# Altium project 24V-20A-Power-Board-v1.0.PrjPcb (part 3 of 5)
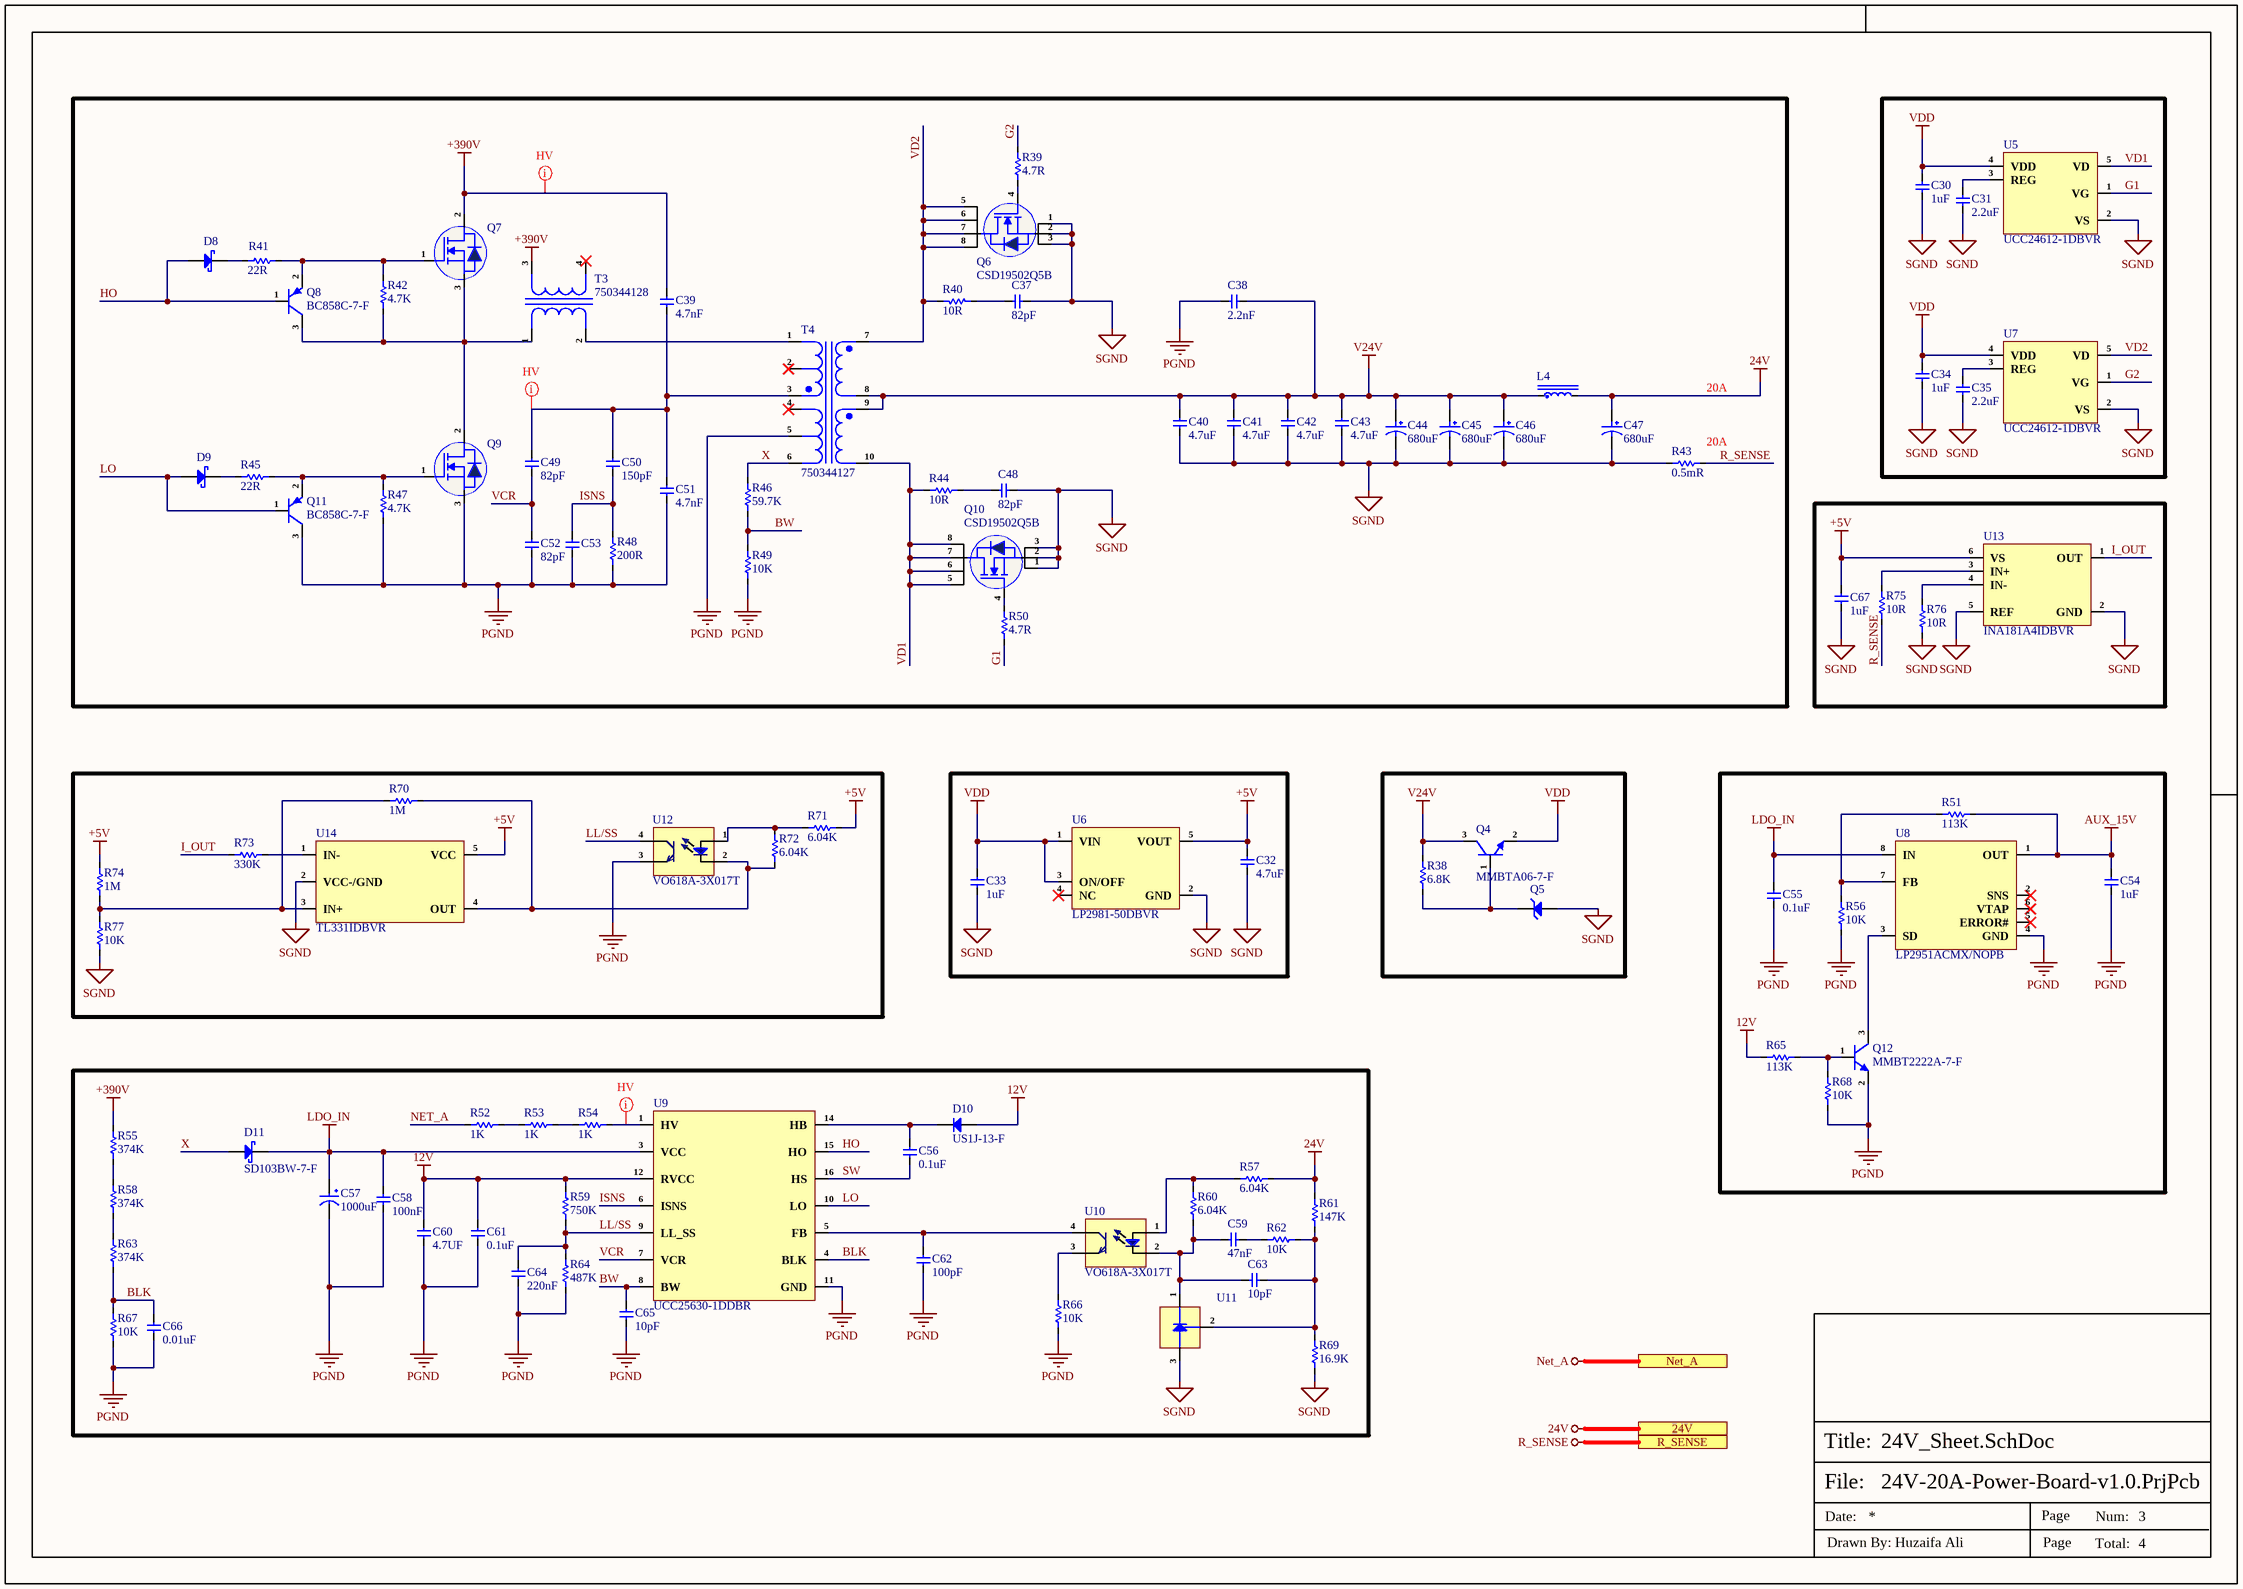
[diagram p5: 24V_Sheet.SchDoc]

## Sheet 24V_Sheet.SchDoc (continued)

### Library data of the parts (continued)
R48 = RC0805FR-07200RL: RES 200 OHM 1% 1/8W 0805; Manufacturer: Yageo; Temperature Coefficient: 100ppm/°C; Voltage Rating (DC): 150V; Power Rating: 125mW; Item Type: Resistor; Supplier: Future Electronics; Supplier Part Number: 6109607; Manufacturer Part Number: RC0805FR-07200RL; RoHS: Yes; Category: Chip SMD Resistors; Stock: 1070000; Pricing: 5000=0.0026, 25000=0.0024, 125000=0.0023, 500000=0.0022, 1250000=0.002 (USD); Mounting Technology: Surface Mount; Case/Package: 0805; Case Code (Metric): 2012; Case Code (Imperial): 0805; Min Operating Temperature: -55°C; Max Operating Temperature: 155°C; Tolerance: 1%; Value: 200R; Packaging: Tape and Reel; Voltage Rating: 150V; Number of Terminations: 2; Termination: SMD/SMT; Max Power Dissipation: 125mW; Features: Moisture Resistant; Series: RC; Construction: Rectangular; Length: 2mm; Depth: 1.25mm; Lead Free: Lead Free; Military Standard: Not; RoHS Compliant: Yes; ComponentLink1URL: https://datasheet.ciiva.com/12667/rc0805-12667066.pdf?src-supplier=Mouser; ComponentLink1Description: https://datasheet.ciiva.com/12667/rc0805-12667066.pdf?src-supplier=Mouser; ComponentLink2URL: https://datasheet.ciiva.com/2519/pyu-r-int-thick-7-2519721.pdf?src-supplier=Digi-Key; ComponentLink2Description: https://datasheet.ciiva.com/2519/pyu-r-int-thick-7-2519721.pdf?src-supplier=Digi-Key; ComponentLink3URL: https://datasheet.ciiva.com/2519/pyu-r-int-thick-7-2519722.pdf?src-supplier=Digi-Key; ComponentLink3Description: https://datasheet.ciiva.com/2519/pyu-r-int-thick-7-2519722.pdf?src-supplier=Digi-Key; ComponentLink4URL: https://datasheet.ciiva.com/2519/pyu-r-int-thick-7-2519720.pdf?src-supplier=Digi-Key; ComponentLink4Description: https://datasheet.ciiva.com/2519/pyu-r-int-thick-7-2519720.pdf?src-supplier=Digi-Key; ComponentLink5URL: https://datasheet.ciiva.com/15189/getdatasheetpartid-327982-15189926.pdf?src-supplier=Verical; ComponentLink5Description: https://datasheet.ciiva.com/15189/getdatasheetpartid-327982-15189926.pdf?src-supplier=Verical; LCSC Part Number: C114567
R49 R56 R62 R66-R68 R77 = RC0603FR-0710KL: RES SMD 10K Ohm 1% 1/10W 0603; Manufacturer: Yageo; Resistance: 10kR; Temperature Coefficient: 100ppm/°C; Voltage Rating (DC): 50V; Power Rating: 100mW; Voltage Rating: 75V; Item Type: Resistor; Supplier 1: Digi-Key; Manufacturer Part Number: RC0603FR-0710KL; RoHS: Yes; Category: Chip SMD Resistors; Stock 1: 25249139; Pricing 1: 1=0.10000, 10=0.02400, 100=0.00970, 1000=0.00436, 2500=0.00378 (USD); Case/Package: 0603; Number of Pins: 2; Case Code (Imperial): 0603; Case Code (Metric): 1608; Weight: 7.1E-05oz; Size Code: 0603; Min Operating Temperature: -55°C; Max Operating Temperature: 155°C; Tolerance: 1%; Resistor Type: Thick Film; Packaging: Tape and Reel; Termination: SMD/SMT; Features: Moisture Resistant; Series: RC; Max Power Dissipation: 100mW; Number of Terminations: 2; Resistance Tolerance: 1%; Construction: Rectangular; Length: 1.6mm; Width: 0.8mm; Height: 0.45mm; Depth: 0.8mm; Lead Pitch: 0.3mm; REACH SVHC: Unknown; Lead Free: Lead Free; Military Standard: Not; RoHS Compliant: Yes; ComponentLink1URL: https://datasheet.ciiva.com/7660/38590-7660789.pdf?src-supplier=Element14; ComponentLink1Description: https://datasheet.ciiva.com/7660/38590-7660789.pdf?src-supplier=Element14; ComponentLink2URL: https://datasheet.ciiva.com/7983/443971-7983596.pdf?src-supplier=Element14; ComponentLink2Description: https://datasheet.ciiva.com/7983/443971-7983596.pdf?src-supplier=Element14; ComponentLink3URL: https://datasheet.ciiva.com/22747/443971-22747519.pdf?src-supplier=Element14; ComponentLink3Description: https://datasheet.ciiva.com/22747/443971-22747519.pdf?src-supplier=Element14; ComponentLink4URL: https://datasheet.ciiva.com/46440/1868787-46440891.pdf?src-supplier=Element14; ComponentLink4Description: https://datasheet.ciiva.com/46440/1868787-46440891.pdf?src-supplier=Element14; ComponentLink5URL: https://datasheet.ciiva.com/7746/1738695-7746239.pdf?src-supplier=Element14; ComponentLink5Description: https://datasheet.ciiva.com/7746/1738695-7746239.pdf?src-supplier=Element14; ComponentLink6URL: https://datasheet.ciiva.com/15189/getdatasheetpartid-409289-15189591.pdf?src-supplier=Verical; ComponentLink6Description: https://datasheet.ciiva.com/15189/getdatasheetpartid-409289-15189591.pdf?src-supplier=Verical; Supplier Part Number 1: 311-10.0KHRCT-ND; LCSC Part Number: C98220
R51 R65 = RC0603FR-07113KL: RES 113K OHM 1% 1/10W 0603; Manufacturer: Yageo; Value: 113kR; Temperature Coefficient: 100ppm/°C; Power Rating: 100mW; Voltage Rating: 50V; Supplier: Digikey; Supplier Part Number: 311-113KHRCT-ND; Manufacturer Part Number: RC0603FR-07113KL; RoHS: Yes; Category: Chip SMD Resistors; Stock: 1058641; Pricing: 1=0.1, 10=0.019, 50=0.0112, 100=0.0093, 500=0.00622, 1000=0.00532 (USD); Case/Package: 0603; Contact Plating: Tin,Lead; Case Code (Imperial): 0603; Case Code (Metric): 1608; Min Operating Temperature: -55°C; Max Operating Temperature: 155°C; Tolerance: 1%; Packaging: Tape and Reel; Termination: SMD/SMT; Voltage Rating (DC): 50V; Features: Moisture Resistant; Series: RC; Max Power Dissipation: 100mW; Number of Terminations: 2; Length: 1.6mm; Width: 0.8mm; Height: 0.45mm; Lead Free: Lead Free; RoHS Compliant: Resistor; ComponentLink1URL: http://www.mouser.com/catalog/specsheets/RC0603.pdf?src-supplier=Mouser; ComponentLink1Description: http://www.mouser.com/catalog/specsheets/RC0603.pdf?src-supplier=Mouser; ComponentLink2URL: http://www.yageo.com/pdf/PYu-RC0603_51_RoHS_L_4.pdf?src-supplier=Avnet; ComponentLink2Description: http://www.yageo.com/pdf/PYu-RC0603_51_RoHS_L_4.pdf?src-supplier=Avnet; ComponentLink3URL: http://www.yageo.com/documents/recent/PYu-RC_Group_51_RoHS_L_9.pdf?src-supplier=Digikey; ComponentLink3Description: http://www.yageo.com/documents/recent/PYu-RC_Group_51_RoHS_L_9.pdf?src-supplier=Digikey; ComponentLink4URL: http://www.yageo.com/documents/recent/PYu-RC_Group_51_RoHS_L_10.pdf?src-supplier=Digikey; ComponentLink4Description: http://www.yageo.com/documents/recent/PYu-RC_Group_51_RoHS_L_10.pdf?src-supplier=Digikey; ComponentLink5URL: https://datasheet.octopart.com/RC0603FR-07113KL-Yageo-datasheet-118562.pdf?src-supplier=Digikey; ComponentLink5Description: https://datasheet.octopart.com/RC0603FR-07113KL-Yageo-datasheet-118562.pdf?src-supplier=Digikey; ComponentLink6URL: http://www.yageo.com/documents/recent/PYu-RC0603_51_RoHS_L_7.pdf?src-supplier=Future+Electronics; ComponentLink6Description: http://www.yageo.com/documents/recent/PYu-RC0603_51_RoHS_L_7.pdf?src-supplier=Future+Electronics; ComponentLink7URL: https://datasheet.octopart.com/RC0603FR-07113KL-Yageo-datasheet-164759695.pdf?src-supplier=Future+Electronics; ComponentLink7Description: https://datasheet.octopart.com/RC0603FR-07113KL-Yageo-datasheet-164759695.pdf?src-supplier=Future+Electronics
R52-R54 = RC1206FR-7W1KL: RES 1K OHM 1% 1/2W 1206; Manufacturer: Yageo; Item Type: Resistor; Supplier 1: Digi-Key; Manufacturer Part Number: RC1206FR-7W1KL; RoHS: Yes; Category: Chip SMD Resistors; Stock 1: 6215; Pricing 1: 1=0.19000, 10=0.15700, 100=0.06150, 1000=0.02572, 2500=0.02358 (USD); RoHS Compliant: Yes; Supplier Part Number 1: 13-RC1206FR-7W1KLCT-ND; LCSC Part Number: C859155; ComponentLink1Description: LCSC; ComponentLink1URL: https://www.lcsc.com/product-detail/Chip-Resistor-Surface-Mount_YAGEO-RC1206FR-7W1KL_C859155.html
R55 R58 R63 = RNCF1206DTE374K: RES SMD 374K OHM 0.5% 1/4W 1206; Manufacturer: Stackpole Electronics; Item Type: Resistors; Value: 374kR; Max Power Dissipation: 250mW; Temperature Coefficient: 25ppm/°C; Supplier: Digikey; LCSC Part Number: C346652; Manufacturer Part Number: RNCF1206DTE374K; RoHS: Yes; Pricing: 5000=0.03682 (USD); Mounting Technology: Surface Mount; Case/Package: 1206; Case Code (Metric): 3216; Case Code (Imperial): 1206; Min Operating Temperature: -55°C; Max Operating Temperature: 155°C; Tolerance: 0.5%; Packaging: Cut Tape; Number of Terminations: 2; Features: Moisture Resistant; Series: RNCF; Length: 0.126inch; Width: 0.063inch; Height: 0.026inch; RoHS Compliant: Yes; ComponentLink1URL: https://www.seielect.com/Catalog/SEI-RNCF.pdf?src-supplier=Digikey; ComponentLink1Description: https://www.seielect.com/Catalog/SEI-RNCF.pdf?src-supplier=Digikey
R57 R60 R71 R72 = RC0402FR-076K04L: RES 6.04K OHM 1% 1/16W 0402; Manufacturer: Yageo; Resistance: 6.04kR; Temperature Coefficient: 100ppm/°C; Power Rating: 62.5mW; Voltage Rating: 50V; Max Power Dissipation: 63mW; Supplier 1: Mouser; Manufacturer Part Number: RC0402FR-076K04L; RoHS: Yes; Category: Chip SMD Resistors; Stock 1: 365311; Pricing 1: 1=0.10000, 10=0.01200, 50=0.01200, 100=0.00500, 1000=0.00300, 2500=0.00200, 10000=0.00100 (USD); Case/Package: 0402; Contact Plating: Tin,Matte; Case Code (Imperial): 0402; Case Code (Metric): 1005; Min Operating Temperature: -55°C; Max Operating Temperature: 155°C; Tolerance: 1%; Resistor Type: Thick Film; Packaging: Tape and Reel; Package Quantity: 10000; Number of Terminations: 2; Termination: SMD/SMT; Voltage Rating (DC): 50V; Working Voltage: 50V; Features: Moisture Resistant; Series: RC; Technology: THICK FILM; Construction: Rectangular; Length: 1mm; Width: 0.02inch; Height: 0.016inch; Depth: 0.5mm; Military Standard: Not; Lead Free: Lead Free; RoHS Compliant: Yes; ComponentLink1URL: https://datasheet.ciiva.com/5558/pyu-rc0402-51-rohs-l-6-r-5558087.pdf?src-supplier=Mouser; ComponentLink1Description: https://datasheet.ciiva.com/5558/pyu-rc0402-51-rohs-l-6-r-5558087.pdf?src-supplier=Mouser; ComponentLink2URL: https://datasheet.ciiva.com/8892/pyu-rc0402-51-rohs-l-6-8892414.pdf?src-supplier=Avnet; ComponentLink2Description: https://datasheet.ciiva.com/8892/pyu-rc0402-51-rohs-l-6-8892414.pdf?src-supplier=Avnet; ComponentLink3URL: https://datasheet.ciiva.com/2552/pyu-r-int-thick-7-2552970.pdf?src-supplier=Digi-Key; ComponentLink3Description: https://datasheet.ciiva.com/2552/pyu-r-int-thick-7-2552970.pdf?src-supplier=Digi-Key; Supplier Part Number 1: 603-RC0402FR-076K04L; LCSC Part Number: C97819
R59 = 0603WAF7503T5E: 100mW Thick Film Resistors 75V ±100ppm/℃ ±1% 750kΩ 0603 Chip Resistor - Surface Mount ROHS; Manufacturer: UNI-ROYAL; Manufacturer Part Number: 0603WAF7503T5E; Package: 0603; LCSC Part Number: C23240; Item Type: Resistor; ComponentLink1Description: LCSC; ComponentLink1URL: https://www.lcsc.com/product-detail/Chip-Resistor-Surface-Mount_UNI-ROYAL-Uniroyal-Elec-0603WAF7503T5E_C23240.html
R61 = RT0603DRD07147KL: RES SMD 147K OHM 0.5% 1/10W 0603; Manufacturer: Yageo; Power Rating: 100mW; Voltage Rating (DC): 50V; Value: 147kR; Temperature Coefficient: 25ppm/°C; Item Type: Resistor; Supplier 1: Mouser; Manufacturer Part Number: RT0603DRD07147KL; RoHS: Yes; Category: Chip SMD Resistors; Stock 1: 1848; Pricing 1: 1=0.18000, 10=0.14700, 50=0.14700, 100=0.05600, 1000=0.02400, 10000=0.01800 (USD); Case/Package: 0603; Case Code (Imperial): 0603; Case Code (Metric): 1608; Min Operating Temperature: -55°C; Max Operating Temperature: 155°C; Package Quantity: 10; Tolerance: 0.5%; Packaging: Tape and Reel; Series: RT; Max Power Dissipation: 100mW; Number of Terminations: 2; Length: 1.6mm; Width: 0.8mm; Height: 0.45mm; Lead Free: Lead Free; RoHS Compliant: Yes; ComponentLink1URL: http://www.yageo.com/documents/recent/PYu-RT_1-to-0.01_RoHS_L_9.pdf?src-supplier=Digi-Key; ComponentLink1Description: http://www.yageo.com/documents/recent/PYu-RT_1-to-0.01_RoHS_L_9.pdf?src-supplier=Digi-Key; Supplier Part Number 1: 603-RT0603DRD07147KL; LCSC Part Number: C728612
R64 = RC0603DR-07487KL: RES 487K OHM 0.5% 1/10W 0603; Manufacturer: Yageo; Item Type: Resistors; Value: 487kR; Max Power Dissipation: 100mW; Temperature Coefficient: 100ppm/°C; Supplier: Digikey; LCSC Part Number: C859043; Manufacturer Part Number: RC0603DR-07487KL; RoHS: Yes; Pricing: 5000=0.00887 (USD); Case/Package: 0603; Min Operating Temperature: -55°C; Max Operating Temperature: 155°C; Packaging: Tape and Reel; Number of Terminations: 2; Tolerance: 0.5%; Features: Moisture Resistant; Series: RC; Length: 0.063inch; Width: 0.031inch; Height: 0.022inch; RoHS Compliant: Yes; ComponentLink1URL: http://www.yageo.com.tw/exep/pages/download/literatures/PYu-R_INT-thick_7.pdf?src-supplier=Digikey; ComponentLink1Description: http://www.yageo.com.tw/exep/pages/download/literatures/PYu-R_INT-thick_7.pdf?src-supplier=Digikey
R69 = 0603WAF1692T5E: 100mW Thick Film Resistors 75V ±100ppm/℃ ±1% 16.9kΩ 0603 Chip Resistor - Surface Mount ROHS; Manufacturer: UNI-ROYAL; Manufacturer Part Number: 0603WAF1692T5E; Package: 0603; LCSC Part Number: C25954; Item Type: Resistor; ComponentLink1Description: LCSC; ComponentLink1URL: https://www.lcsc.com/product-detail/Chip-Resistor-Surface-Mount_UNI-ROYAL-Uniroyal-Elec-0603WAF1692T5E_C25954.html
R70 R74 = RC0402FR-071ML: RES 1M OHM 1% 1/16W 0402; Manufacturer: Yageo; Value: 1MR; Power Rating: 63mW; Voltage Rating: 50V; Temperature Coefficient: 100ppm/°C; Item Type: Resistor; Supplier: Digikey; Supplier Part Number: 311-1.00MLRCT-ND; Manufacturer Part Number: RC0402FR-071ML; RoHS: Yes; Category: Chip SMD Resistors; Stock: 6516; Pricing: 1=0.1, 10=0.015, 50=0.0088, 100=0.0073, 500=0.00488, 1000=0.00417, 5000=0.00297 (USD); Case/Package: 0402; Case Code (Imperial): 0402; Case Code (Metric): 1005; Min Operating Temperature: -55°C; Max Operating Temperature: 155°C; Resistor Type: Thick Film; Packaging: Tape and Reel; Tolerance: 1%; Termination: SMD/SMT; Features: Moisture Resistant; Series: RC; Max Power Dissipation: 63mW; Number of Terminations: 2; Resistance Tolerance: 1%; Construction: Rectangular; Technology: THICK FILM; Voltage Rating (AC): 50V; Length: 1mm; Height: 0.32mm; Depth: 0.5mm; RoHS Compliant: Yes; Military Standard: Not; Reach SVHC Compliant: Unknown; Lead Free: 5697LeadFree; ComponentLink1URL: https://datasheet.ciiva.com/11808/0900766b80c66297-11808125.pdf?src-supplier=Rs; ComponentLink1Description: https://datasheet.ciiva.com/11808/0900766b80c66297-11808125.pdf?src-supplier=Rs; ComponentLink2URL: https://datasheet.ciiva.com/46394/1018594-46394951.pdf?src-supplier=Element14; ComponentLink2Description: https://datasheet.ciiva.com/46394/1018594-46394951.pdf?src-supplier=Element14; ComponentLink3URL: https://datasheet.ciiva.com/7849/1018594-7849883.pdf?src-supplier=Element14; ComponentLink3Description: https://datasheet.ciiva.com/7849/1018594-7849883.pdf?src-supplier=Element14; ComponentLink4URL: https://datasheet.ciiva.com/7849/1018594-7849882.pdf?src-supplier=Element14; ComponentLink4Description: https://datasheet.ciiva.com/7849/1018594-7849882.pdf?src-supplier=Element14; ComponentLink5URL: https://datasheet.ciiva.com/16741/pyu-rc0402-51-rohs-l-6-r-16741081.pdf?src-supplier=Future+Electronics; ComponentLink5Description: https://datasheet.ciiva.com/16741/pyu-rc0402-51-rohs-l-6-r-16741081.pdf?src-supplier=Future+Electronics; LCSC Part Number: C138033
R73 = CRCW0402330KFKEDC: RES 330K OHM 1% 1/16W 0402; Manufacturer: Vishay; Power Rating: 63mW; Value: 330kR; Item Type: Resistor; Supplier: Mouser; Supplier Part Number: 71-CRCW0402330KFKEDC; Manufacturer Part Number: CRCW0402330KFKEDC; RoHS: Yes; Category: Chip SMD Resistors; Stock: 34154; Pricing: 1=0.1, 10=0.017, 50=0.017, 100=0.008, 1000=0.005, 10000=0.004 (USD); Case/Package: 0402; Tolerance: 1%; Lead Free: Lead Free; RoHS Compliant: Yes; LCSC Part Number: C3009051
T3 = 750344128: Manufacturer: Wurth Electroniks; Item Type: Transformer; Manufacturer Part Number: 750344128; Package: THT
T4 = 750344127: Manufacturer: Wurth Electroniks; Item Type: Transformer; Manufacturer Part Number: 750344127; Package: THT
U5 U7 = UCC24612-1DBVR: SYNC RECTIFIER FLYBACK; Manufacturer: Texas Instruments; Item Type: IC; Supplier: Mouser; LCSC Part Number: C2657796; Manufacturer Part Number: UCC24612-1DBVR; RoHS: Yes; Stock: 14678; Pricing: 1=0.92, 10=0.757, 50=0.757, 100=0.574, 1000=0.391, 10000=0.302 (USD); ComponentLink1URL: http://www.ti.com/general/docs/suppproductinfo.tsp?distId=10&amp;gotoUrl=http%3A%2F%2Fwww.ti.com%2Flit%2Fgpn%2Fucc24612&src-supplier=Digikey; ComponentLink1Description: http://www.ti.com/general/docs/suppproductinfo.tsp?distId=10&amp;gotoUrl=http%3A%2F%2Fwww.ti.com%2Flit%2Fgpn%2Fucc24612&src-supplier=Digikey
U6 = LP2981-50DBVR: IC REG LINEAR 5V 100MA SOT23-5; Manufacturer: Texas Instruments; Supplier: Mouser; LCSC Part Number: C2877856; Manufacturer Part Number: LP2981-50DBVR; RoHS: Yes; Item Type: IC; Stock: 14435; Pricing: 1=0.34, 10=0.274, 50=0.274, 100=0.203, 1000=0.138, 10000=0.137 (USD); ComponentLink1URL: https://datasheet.ciiva.com/2042/lp2981a-50-2042256.pdf?src-supplier=Digikey; ComponentLink1Description: https://datasheet.ciiva.com/2042/lp2981a-50-2042256.pdf?src-supplier=Digikey; ComponentLink2URL: https://datasheet.ciiva.com/41458/001014295-da-01-en-ic-reg-ldo-5v-0-lp2981-50dbvr-sot-5-tid-41458697.pdf?src-supplier=Conrad; ComponentLink2Description: https://datasheet.ciiva.com/41458/001014295-da-01-en-ic-reg-ldo-5v-0-lp2981-50dbvr-sot-5-tid-41458697.pdf?src-supplier=Conrad; ComponentLink3URL: https://datasheet.ciiva.com/3223/lp2981a-33-3223861.pdf?src-supplier=Avnet; ComponentLink3Description: https://datasheet.ciiva.com/3223/lp2981a-33-3223861.pdf?src-supplier=Avnet; ComponentLink4URL: https://datasheet.ciiva.com/2042/lp2981a-50-2042254.pdf?src-supplier=Digikey; ComponentLink4Description: https://datasheet.ciiva.com/2042/lp2981a-50-2042254.pdf?src-supplier=Digikey; ComponentLink5URL: https://datasheet.ciiva.com/2042/lp2981a-50-2042255.pdf?src-supplier=Digikey; ComponentLink5Description: https://datasheet.ciiva.com/2042/lp2981a-50-2042255.pdf?src-supplier=Digikey
U8 = LP2951ACMX/NOPB: IC REG LIN POS ADJ 100MA 8SOIC; Manufacturer: TI National Semiconductor; Quiescent Current: 75uA; Max Supply Voltage: 30V; Min Supply Voltage: 2.3V; Supplier: Mouser; LCSC Part Number: C67596; Manufacturer Part Number: LP2951ACMX/NOPB; RoHS: Yes; Item Type: IC; Stock: 19390; Pricing: 1=0.89, 10=0.732, 50=0.732, 100=0.542, 1000=0.369, 10000=0.308 (USD); Nominal Supply Current: 75uA; Length: 4.9mm; Width: 3.91mm; Height: 1.75mm; Thickness: 1.58mm; ComponentLink1URL: https://datasheet.ciiva.com/27052/1323645-27052000.pdf?src-supplier=Jameco; ComponentLink1Description: https://datasheet.ciiva.com/27052/1323645-27052000.pdf?src-supplier=Jameco; ComponentLink2URL: https://datasheet.ciiva.com/41458/001014279-da-01-en-ic-reg-ldo-ad-lp2951acmx-nopb-soic-8-tid-41458660.pdf?src-supplier=Conrad; ComponentLink2Description: https://datasheet.ciiva.com/41458/001014279-da-01-en-ic-reg-ldo-ad-lp2951acmx-nopb-soic-8-tid-41458660.pdf?src-supplier=Conrad; ComponentLink3URL: https://datasheet.ciiva.com/3223/lp2950-n-3223829.pdf?src-supplier=Avnet; ComponentLink3Description: https://datasheet.ciiva.com/3223/lp2950-n-3223829.pdf?src-supplier=Avnet; ComponentLink4URL: https://datasheet.ciiva.com/3223/lp2950-n-3223830.pdf?src-supplier=Avnet; ComponentLink4Description: https://datasheet.ciiva.com/3223/lp2950-n-3223830.pdf?src-supplier=Avnet; ComponentLink5URL: https://datasheet.ciiva.com/4886/lp2950-n-4886917.pdf?src-supplier=Mouser; ComponentLink5Description: https://datasheet.ciiva.com/4886/lp2950-n-4886917.pdf?src-supplier=Mouser; ComponentLink6URL: https://datasheet.ciiva.com/6597/lp2950-n-6597112.pdf?src-supplier=Digikey; ComponentLink6Description: https://datasheet.ciiva.com/6597/lp2950-n-6597112.pdf?src-supplier=Digikey; ComponentLink7URL: https://datasheet.ciiva.com/6597/lp2950-n-6597113.pdf?src-supplier=Digikey; ComponentLink7Description: https://datasheet.ciiva.com/6597/lp2950-n-6597113.pdf?src-supplier=Digikey; ComponentLink8URL: https://datasheet.ciiva.com/6597/lp2950-n-6597114.pdf?src-supplier=Digikey; ComponentLink8Description: https://datasheet.ciiva.com/6597/lp2950-n-6597114.pdf?src-supplier=Digikey
U9 = UCC25630-1DDBR: Half-Bridge Regulator Positive, Isolation Capable Output DC-DC Controller IC 14-SOIC; Manufacturer: Texas Instruments; Number of Outputs: 1; Switching Frequency: 1MHz; Max Duty Cycle: 50%; Synchronous Rectifier: No; Supplier: Mouser; Supplier Part Number: 595-UCC25630-1DDBR; Manufacturer Part Number: UCC25630-1DDBR; RoHS: Yes; Item Type: IC; Stock: 2241; Pricing: 1=3.78, 10=3.22, 50=3.22, 100=2.79, 1000=2, 10000=1.89 (USD); Case/Package: SOIC; Min Operating Temperature: -40°C; Max Operating Temperature: 125°C; Packaging: Cut Tape; Number of Output Phases: 1; Clock Sync: No; Series: -; RoHS Compliant: Yes; ComponentLink1URL: http://www.ti.com/lit/sg/slyt728/slyt728.pdf?src-supplier=Digikey; ComponentLink1Description: http://www.ti.com/lit/sg/slyt728/slyt728.pdf?src-supplier=Digikey; ComponentLink2URL: http://www.ti.com/general/docs/suppproductinfo.tsp?distId=10&amp;gotoUrl=http%3A%2F%2Fwww.ti.com%2Flit%2Fgpn%2Fucc256301&src-supplier=Digikey; ComponentLink2Description: http://www.ti.com/general/docs/suppproductinfo.tsp?distId=10&amp;gotoUrl=http%3A%2F%2Fwww.ti.com%2Flit%2Fgpn%2Fucc256301&src-supplier=Digikey
U10 U12 = VO618A-3X017T: OPTOISOLATOR 5.3KV TRANS 4-SMD; Manufacturer: Vishay Semiconductors; Item Type: IC; Supplier: Mouser; LCSC Part Number: C143748; Manufacturer Part Number: VO618A-3X017T; RoHS: Yes; Stock: 90870; Pricing: 1=0.37, 10=0.242, 50=0.242, 100=0.16, 1000=0.136, 10000=0.106 (USD); ComponentLink1URL: https://datasheet.ciiva.com/2087/vo618a-2087431.pdf?src-supplier=Digikey; ComponentLink1Description: https://datasheet.ciiva.com/2087/vo618a-2087431.pdf?src-supplier=Digikey; ComponentLink2URL: https://datasheet.ciiva.com/2087/vo618a-2087432.pdf?src-supplier=Digikey; ComponentLink2Description: https://datasheet.ciiva.com/2087/vo618a-2087432.pdf?src-supplier=Digikey; ComponentLink3URL: https://datasheet.ciiva.com/2087/vo618a-2087433.pdf?src-supplier=Digikey; ComponentLink3Description: https://datasheet.ciiva.com/2087/vo618a-2087433.pdf?src-supplier=Digikey
U11 = TL431ACDBZR: IC VREF SHUNT ADJ 1% SOT23-3; Manufacturer: Texas Instruments; Output Current: 100mA; Temperature Coefficient: 34ppm/°C; Cathode Current: 600uA; Reference Type: Shunt,Adjustable; Output Voltage: 36V; Max Supply Voltage: 37V; Min Output Voltage: 2.495V; Output Type: Adjustable; Supplier: Mouser; LCSC Part Number: C350683; Manufacturer Part Number: TL431ACDBZR; RoHS: Yes; Item Type: IC; Stock: 33202; Pricing: 1=0.42, 10=0.283, 50=0.283, 100=0.134, 1000=0.103, 10000=0.079 (USD); Case/Package: SOT-23; Pins: 3; Min Operating Temperature: -40°C; Max Operating Temperature: 125°C; Packaging: Tape and Reel; Package Quantity: 3000; Tolerance: 1%; Series: -; Max Output current: 100mA; Reference Voltage: 36V; Max Output Voltage: 36V; Min Input Voltage: 2.495V; Termination: SMD/SMT; Thickness: 1mm; Radiation Hardening: No; Lead Free: Lead Free; RoHS Compliant: Yes; Reach SVHC Compliant: No; ComponentLink1URL: https://datasheet.ciiva.com/15149/getdatasheetpartid-184457-15149018.pdf?src-supplier=Verical; ComponentLink1Description: https://datasheet.ciiva.com/15149/getdatasheetpartid-184457-15149018.pdf?src-supplier=Verical; ComponentLink2URL: https://datasheet.ciiva.com/2006/tl431a-2006221.pdf?src-supplier=Digikey; ComponentLink2Description: https://datasheet.ciiva.com/2006/tl431a-2006221.pdf?src-supplier=Digikey; ComponentLink3URL: https://datasheet.ciiva.com/2006/tl431a-2006220.pdf?src-supplier=Digikey; ComponentLink3Description: https://datasheet.ciiva.com/2006/tl431a-2006220.pdf?src-supplier=Digikey; ComponentLink4URL: https://datasheet.ciiva.com/2006/tl431a-2006222.pdf?src-supplier=Digikey; ComponentLink4Description: https://datasheet.ciiva.com/2006/tl431a-2006222.pdf?src-supplier=Digikey; ComponentLink5URL: https://datasheet.ciiva.com/3235/tl432b-3235591.pdf?src-supplier=Avnet; ComponentLink5Description: https://datasheet.ciiva.com/3235/tl432b-3235591.pdf?src-supplier=Avnet
U13 = INA181A4IDBVR: IC CURR SENSE 1 CIRCUIT SOT23-6; Manufacturer: Texas Instruments; Supplier: Mouser; Supplier Part Number: 595-INA181A4IDBVR; Manufacturer Part Number: INA181A4IDBVR; RoHS: Yes; Category: Amplifiers - Op Amps, Buffer, Instrumentation; Stock: 25817; Pricing: 1=0.49, 10=0.38, 50=0.38, 100=0.279, 1000=0.164, 10000=0.14 (USD); ComponentLink1URL: http://www.ti.com/lit/ds/symlink/ina181.pdf?src-supplier=Digikey; ComponentLink1Description: http://www.ti.com/lit/ds/symlink/ina181.pdf?src-supplier=Digikey; ComponentLink2URL: http://www.ti.com/general/docs/suppproductinfo.tsp?distId=10&amp;gotoUrl=http%3A%2F%2Fwww.ti.com%2Flit%2Fgpn%2Fina181&src-supplier=Digikey; ComponentLink2Description: http://www.ti.com/general/docs/suppproductinfo.tsp?distId=10&amp;gotoUrl=http%3A%2F%2Fwww.ti.com%2Flit%2Fgpn%2Fina181&src-supplier=Digikey
U14 = TL331IDBVR: IC COMPARATOR 1 DIFF SOT23-5; Manufacturer: Texas Instruments; Supplier: Mouser; LCSC Part Number: C80942; Manufacturer Part Number: TL331IDBVR; RoHS: Yes; Item Type: IC; Stock: 106032; Pricing: 1=0.5, 10=0.396, 50=0.396, 100=0.295, 1000=0.207, 10000=0.152 (USD); ComponentLink1URL: https://datasheet.ciiva.com/1483/1771402-1483765.pdf?src-supplier=Element14; ComponentLink1Description: https://datasheet.ciiva.com/1483/1771402-1483765.pdf?src-supplier=Element14; ComponentLink2URL: https://datasheet.ciiva.com/1827/tl331-1827297.pdf?src-supplier=Digikey; ComponentLink2Description: https://datasheet.ciiva.com/1827/tl331-1827297.pdf?src-supplier=Digikey; ComponentLink3URL: https://datasheet.ciiva.com/1827/tl331-1827298.pdf?src-supplier=Digikey; ComponentLink3Description: https://datasheet.ciiva.com/1827/tl331-1827298.pdf?src-supplier=Digikey; ComponentLink4URL: https://datasheet.ciiva.com/1827/tl331-1827299.pdf?src-supplier=Digikey; ComponentLink4Description: https://datasheet.ciiva.com/1827/tl331-1827299.pdf?src-supplier=Digikey; ComponentLink5URL: https://datasheet.ciiva.com/2970/tl331-2970638.pdf?src-supplier=Avnet; ComponentLink5Description: https://datasheet.ciiva.com/2970/tl331-2970638.pdf?src-supplier=Avnet; ComponentLink6URL: https://datasheet.ciiva.com/2970/tl331-2970639.pdf?src-supplier=Avnet; ComponentLink6Description: https://datasheet.ciiva.com/2970/tl331-2970639.pdf?src-supplier=Avnet; ComponentLink7URL: https://datasheet.ciiva.com/46384/1887693-46384373.pdf?src-supplier=Element14; ComponentLink7Description: https://datasheet.ciiva.com/46384/1887693-46384373.pdf?src-supplier=Element14; ComponentLink8URL: https://datasheet.ciiva.com/46384/1887693-46384376.pdf?src-supplier=Element14; ComponentLink8Description: https://datasheet.ciiva.com/46384/1887693-46384376.pdf?src-supplier=Element14

## Sheet Connector_Sheet.SchDoc
size 420 x 297 mm; SheetNumber: 3; SheetTotal: 3
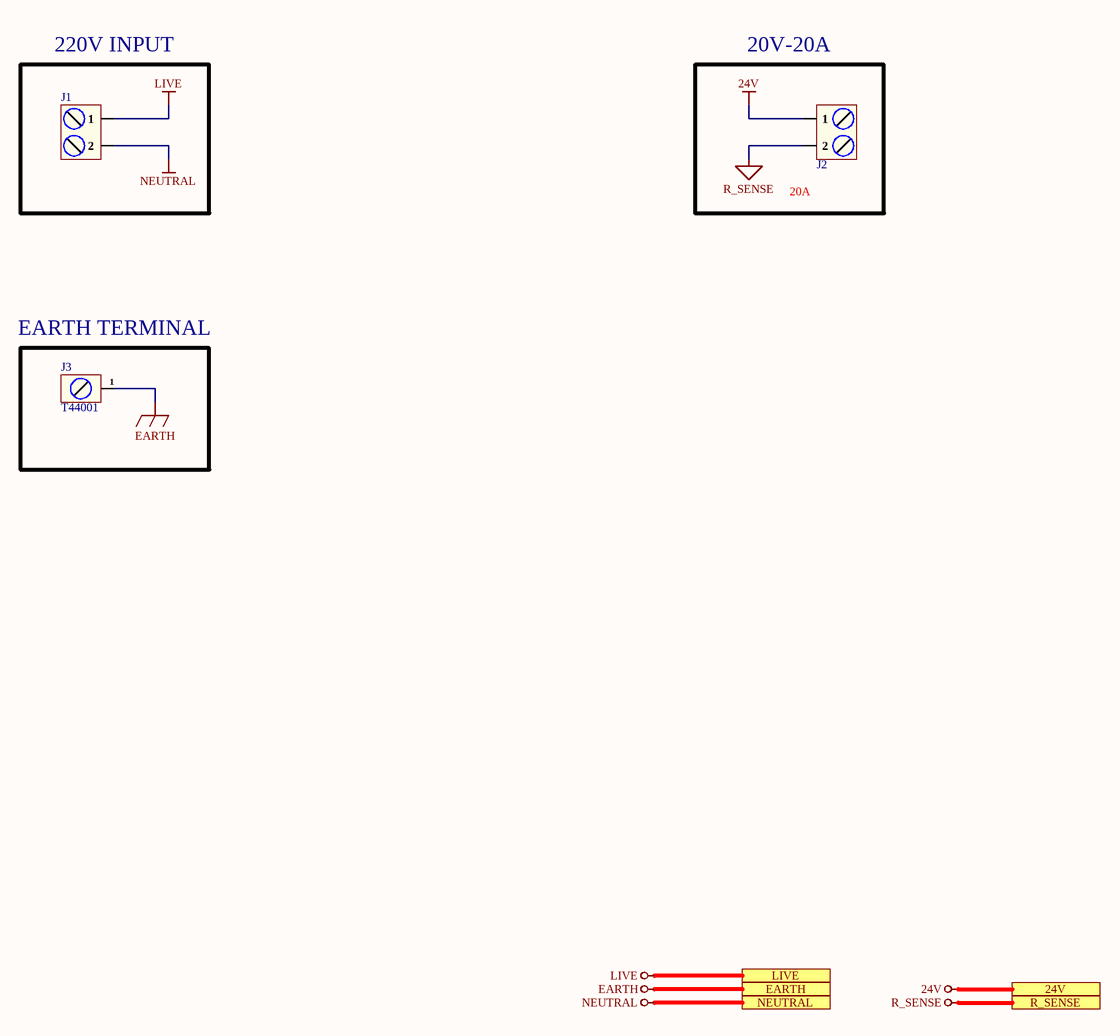
[diagram p2: Connector_Sheet.SchDoc]

### Parts
J1  DBT50G-7.62-2P-BK-P  (value not drawn)
J2  DBT50G-7.62-2P-BK-P  (value not drawn)
J3  T44001  [T44001]

### Blocks framed on the sheet
20A: J2

### Ports
24V (see 24V_Sheet[5D]), EARTH (see Power_Sheet[1A], Power_Sheet[5D]), LIVE (see Power_Sheet[1A], Power_Sheet[5D]), NEUTRAL (see Power_Sheet[1A], Power_Sheet[5D]), R_SENSE (see 24V_Sheet[5D])

### Nets
24V: J2.1 ; port 24V
EARTH: J3.1 ; port EARTH
LIVE: J1.1 ; port LIVE
NEUTRAL: J1.2 ; port NEUTRAL
R_SENSE: J2.2 ; port R_SENSE

### Notes on the sheet
- 220V INPUT
- 20V-20A
- (near J3) EARTH TERMINAL
- File:
- Title:
- Date:
- Page
- Num:
- Total:
- Drawn By: Huzaifa Ali

### Library data of the parts
J1 J2 = DBT50G-7.62-2P-BK-P: 1x2P Corner With Cover Plate 2 1 7.62mm -40℃~+105℃ 20A 300V Black 12~22 Straight Needle Plugin,P=7.62mm Barrier Terminal Blocks ROHS; Manufacturer: DORABO; Manufacturer Part Number: DBT50G-7.62-2P-BK-P; Package: Plugin,P=7.62mm; LCSC Part Number: C496127; Item Type: Terminal Block; ComponentLink1Description: LCSC; ComponentLink1URL: https://www.lcsc.com/product-detail/Barrier-Terminal-Blocks_DORABO-DBT50G-7-62-2P-BK-P_C496127.html
J3 = T44001: M4 Plugin PCB Welding Terminal ROHS; Manufacturer: XFCN; Manufacturer Part Number: T44001; Package: Plugin; ComponentLink1Description: LCSC; ComponentLink1URL: *

## Sheet Power_Sheet.SchDoc
size 420 x 297 mm; SheetNumber: 2; SheetTotal: 4
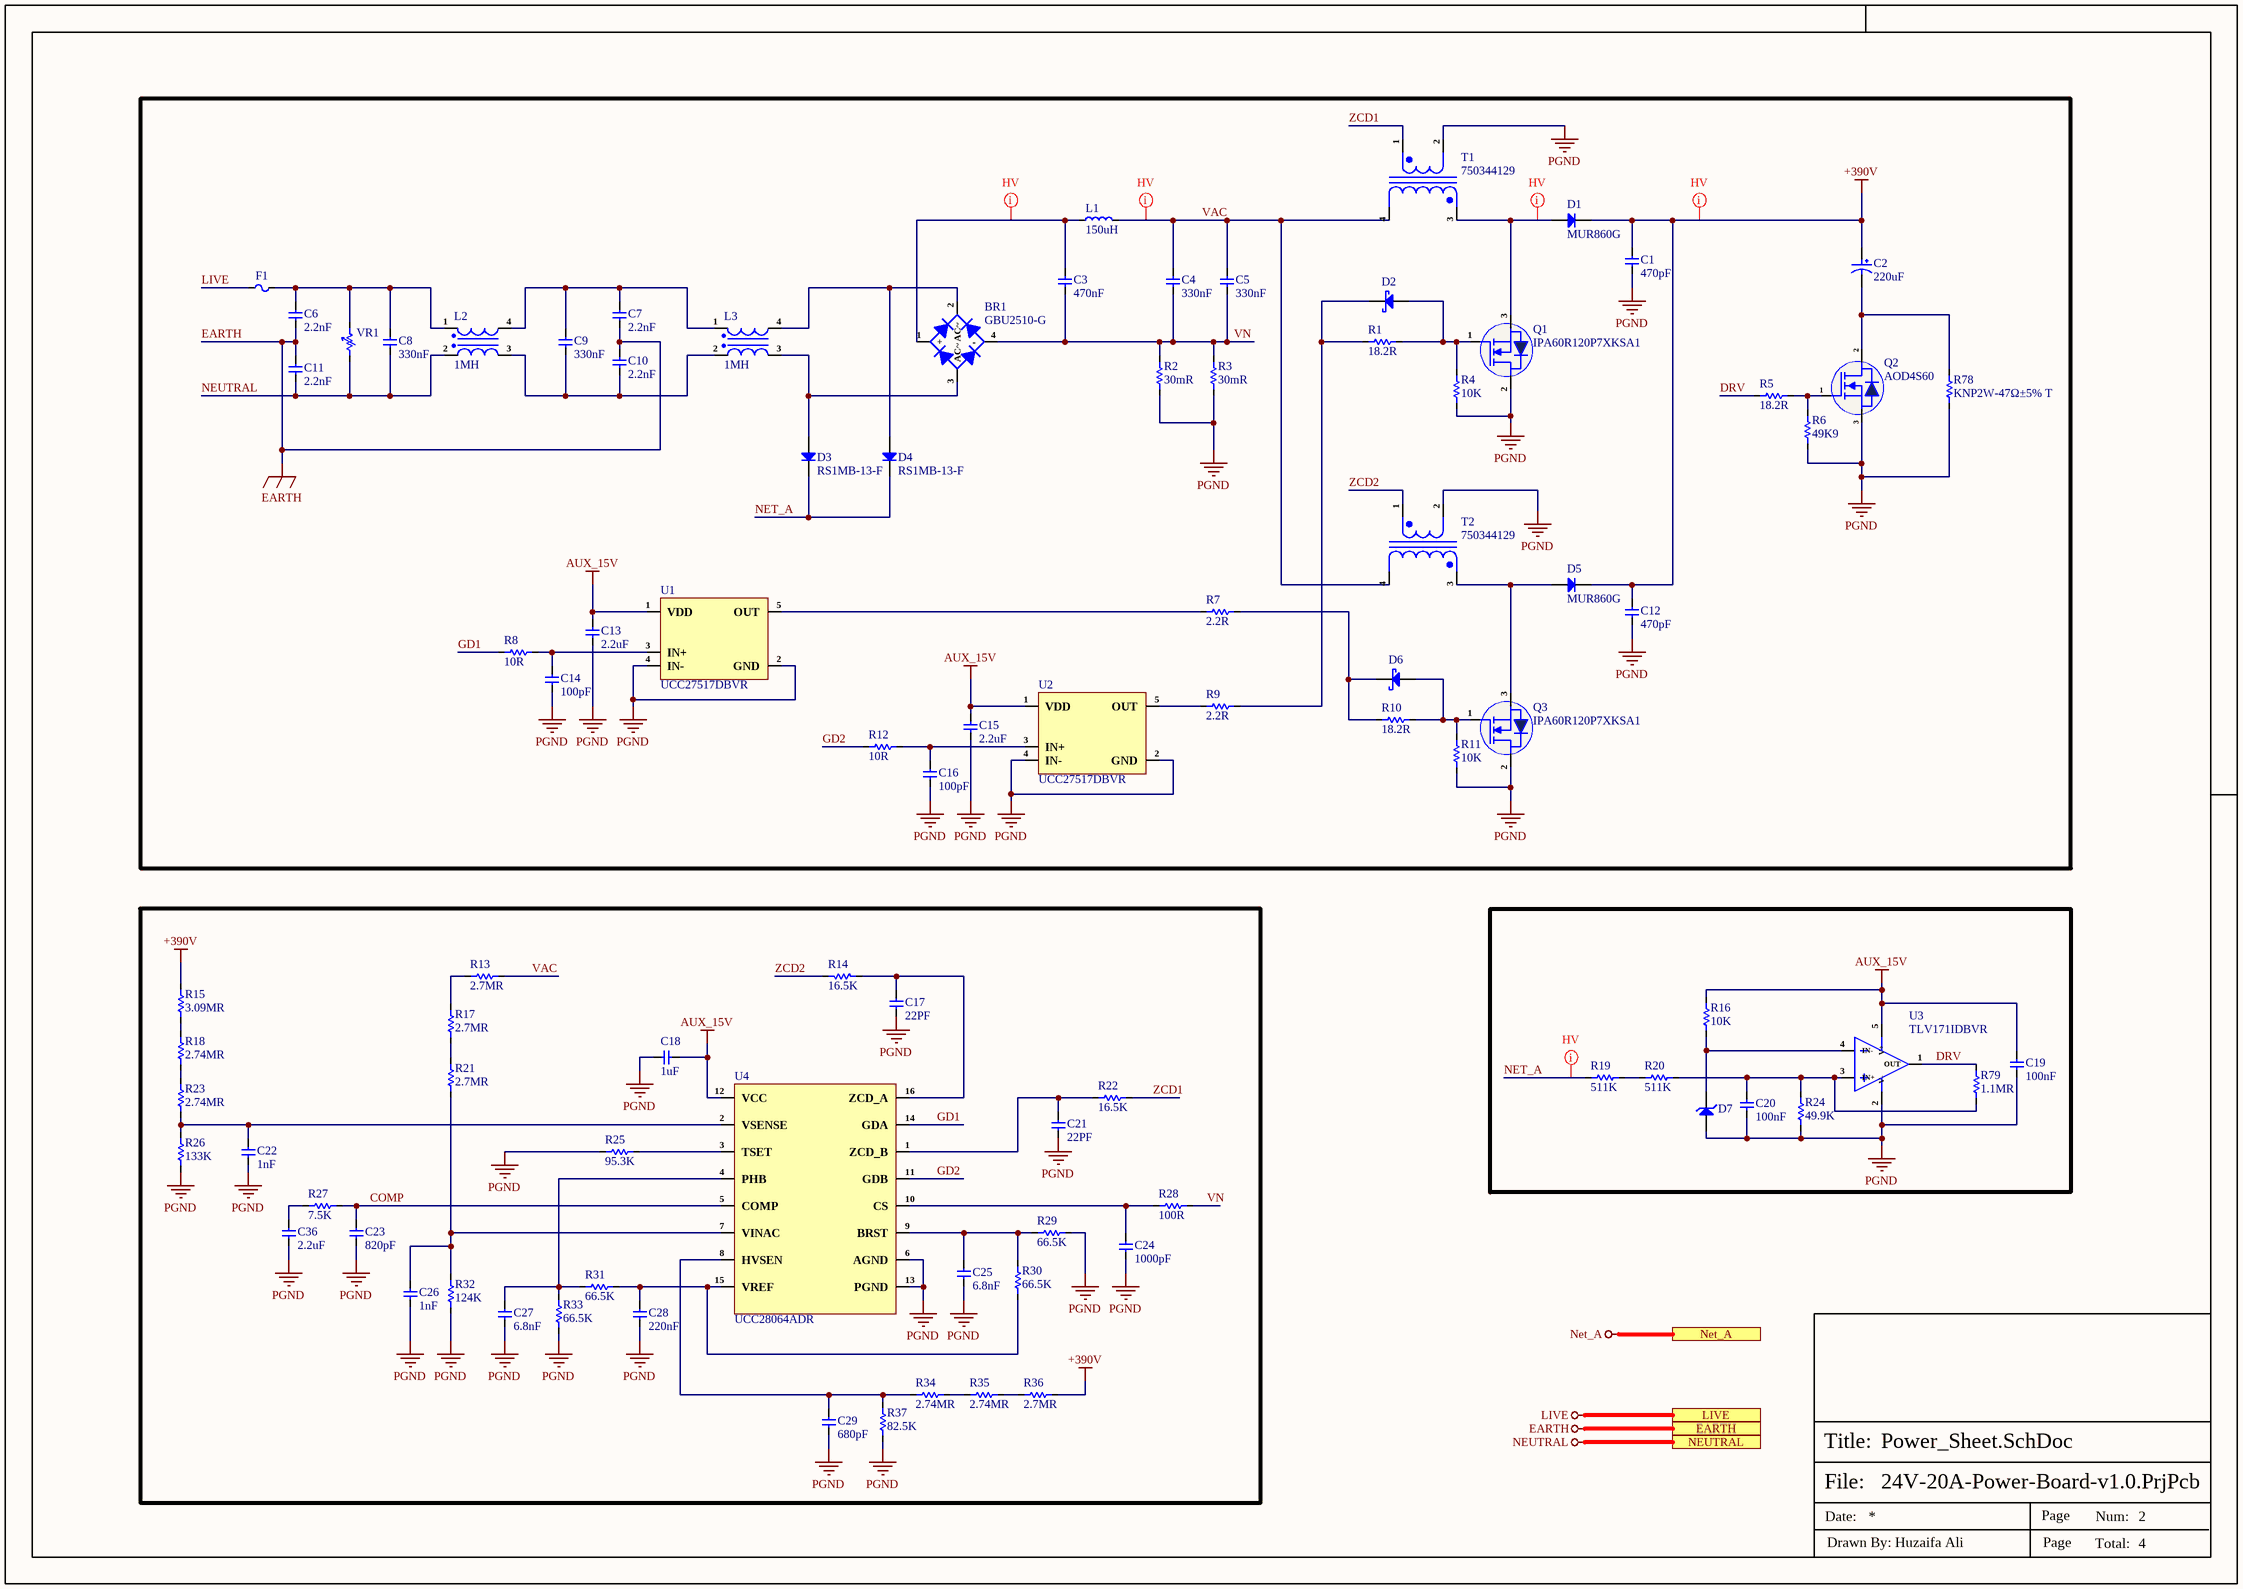
[diagram p3: Power_Sheet.SchDoc]

### Parts
BR1  GBU2510-G  [GBU]
C1  470pF  [Cap-0805]
C2  220uF
C3  470nF  [450MPK474J]
C4  330nF  [MPP334J2J15AJ22800]
C5  330nF  [MPP334J2J15AJ22800]
C6  2.2nF  [AY1222M47Y5UC63L0]
C7  2.2nF  [AY1222M47Y5UC63L0]
C8  330nF
C9  330nF
C10  2.2nF  [AY1222M47Y5UC63L0]
C11  2.2nF  [AY1222M47Y5UC63L0]
C12  470pF  [Cap-0805]
C13  2.2uF  [CAP-0603]
C14  100pF  [Cap-0402]
C15  2.2uF  [CAP-0603]
C16  100pF  [Cap-0402]
C17  22PF  [Cap-0402]
C18  1uF  [Cap-0603]
C19  100nF  [cap-0402]
C20  100nF  [cap-0402]
C21  22PF  [Cap-0402]
C22  1nF  [Cap-0402]
C23  820pF  [Cap-0603]
C24  1000pF  [Cap-0603]
C25  6.8nF  [Cap-0603]
C26  1nF  [Cap-0603]
C27  6.8nF  [Cap-0603]
C28  220nF  [Cap-1206]
C29  680pF  [Cap-0603]
C36  2.2uF  [Cap-0805]
D1  MUR860G  [TO-220-2]
D2  BAT54HT1G  [SOD-323]  (value not drawn)
D3  RS1MB-13-F  [SMB_]
D4  RS1MB-13-F  [SMB_]
D5  MUR860G  [TO-220-2]
D6  BAT54HT1G  [SOD-323]  (value not drawn)
D7  BZT52C5V1S-7-F  [SOD-323]  (value not drawn)
F1  0501010.WR1  [Fuse 1206 (3216 Metric)]  (value not drawn)
L1  150uH  [7447076]
L2  1MH  [7448031501]
L3  1MH  [7448031501]
Q1  IPA60R120P7XKSA1  [TO-220-3]
Q2  AOD4S60  [TO-252-2L]
Q3  IPA60R120P7XKSA1  [TO-220-3]
R1  18.2R  [RES-0805]
R2  30mR  [RES-2512]
R3  30mR  [RES-2512]
R4  10K  [Res-0603]
R5  18.2R  [RES-0805]
R6  49K9  [Res-0603]
R7  2.2R  [Res-0603]
R8  10R  [Res-0402]
R9  2.2R  [Res-0603]
R10  18.2R  [RES-0805]
R11  10K  [Res-0603]
R12  10R  [Res-0402]
R13  2.7MR  [Res-1206]
R14  16.5K  [Res-0603]
R15  3.09MR  [Res-1206]
R16  10K  [Res-0603]
R17  2.7MR  [Res-1206]
R18  2.74MR  [RES-0805]
R19  511K  [Res-1206]
R20  511K  [Res-1206]
R21  2.7MR  [Res-1206]
R22  16.5K  [Res-0603]
R23  2.74MR  [RES-0805]
R24  49.9K  [RES-0805]
R25  95.3K  [Res-0402]
R26  133K  [Res-0603]
R27  7.5K  [Res-0603]
R28  100R  [Res-0603]
R29  66.5K  [Res-0603]
R30  66.5K  [Res-0603]
R31  66.5K  [Res-0603]
R32  124K  [Res-0603]
R33  66.5K  [Res-0603]
R34  2.74MR  [RES-0805]
R35  2.74MR  [RES-0805]
R36  2.7MR  [Res-1206]
R37  82.5K  [Res-0603]
R78  KNP2W-47Ω±5% T  [KNP2W-47O±5]
R79  1.1MR  [Res-0603]
T1  750344129
T2  750344129
U1  UCC27517DBVR  [SOT-23-5]
U2  UCC27517DBVR  [SOT-23-5]
U3  TLV171IDBVR  [SOT-23-5]
U4  UCC28064ADR  [SOIC-16]
VR1  B72210S2271K101  [B72210S2271K101]  (value not drawn)

### Ports
EARTH (see Top_Sheet[4B], Connector_Sheet[4D]), LIVE (see Top_Sheet[4A], Connector_Sheet[4D]), Net_A (see Top_Sheet[4B], 24V_Sheet[5D]), NEUTRAL (see Top_Sheet[4A], Connector_Sheet[4D])

### Nets
+390V: C1.2 C2.1 C12.2 D1.1(K) D5.1(K) R15.2 R36.2
AUX_15V: C13.2 C15.2 C18.2 C19.2 R16.2 U1.1(VDD) U2.1(VDD) U3.5(V+) U4.12(VCC)
EARTH: C6.1 C7.1 C10.2 C11.2 ; port EARTH
LIVE: F1.1 ; port LIVE
NET_A: D3.2(K) D4.2(K) R19.1 ; port Net_A
NEUTRAL: C8.1 C11.1 L2.2 VR1.1 ; port NEUTRAL
PGND: C1.1 C12.1 C13.1 C14.1 C15.1 C16.1 C17.1 C18.1 C19.1 C20.1 C21.1 C22.1 C23.1 C24.1 C25.1 C26.1 C27.1 C28.1 C29.1 C36.1 D7.2(A) Q1.2(D) Q2.3(S) Q3.2(D) R2.1 R3.1 R4.1 R6.1 R11.1 R24.1 R25.1 R26.1 R29.2 R32.1 R33.1 R37.1 R78.1 T1.2 T2.2 U1.2(GND) U1.4(IN-) U2.2(GND) U2.4(IN-) U3.2(V-) U4.6(AGND) U4.13(PGND)
COMP: C23.2 R27.2 U4.5(COMP)
DRV: R5.1 R79.2 U3.1(OUT)
GD1: R8.1 U4.14(GDA)
GD2: R12.1 U4.11(GDB)
VAC: C4.2 C5.2 L1.2 R13.1 T1.4 T2.4
VN: BR1.4(-) C3.1 C4.1 C5.1 R2.2 R3.2 R28.2
ZCD1: R22.2 T1.1
ZCD2: R14.2 T2.1
NetBR1_1: BR1.1(+) C3.2 L1.1
NetBR1_2: BR1.2(AC~) D4.1(A) L3.4
NetBR1_3: BR1.3(AC~) D3.1(A) L3.3
NetC2_2: C2.2 Q2.2(D) R78.2
NetC6_2: C6.2 C8.2 F1.2 L2.1 VR1.2
NetC7_2: C7.2 C9.2 L2.4 L3.1
NetC9_1: C9.1 C10.1 L2.3 L3.2
NetC14_2: C14.2 R8.2 U1.3(IN+)
NetC16_2: C16.2 R12.2 U2.3(IN+)
NetC17_2: C17.2 R14.1 U4.16(ZCD_A)
NetC20_2: C20.2 R20.2 R24.2 R79.1 U3.3(IN+)
NetC21_2: C21.2 R22.1 U4.1(ZCD_B)
NetC22_2: C22.2 R23.1 R26.2 U4.2(VSENSE)
NetC24_2: C24.2 R28.1 U4.10(CS)
NetC25_2: C25.2 R29.1 R30.1 U4.9(BRST)
NetC26_2: C26.2 R21.1 R32.2 U4.7(VINAC)
NetC27_2: C27.2 R31.2 R33.2 U4.4(PHB)
NetC28_2: C28.2 R30.2 R31.1 U4.15(VREF)
NetC29_2: C29.2 R34.1 R37.2 U4.8(HVSEN)
NetC36_2: C36.2 R27.1
NetD1_2: D1.2(A) Q1.3(S) T1.3
NetD2_1: D2.1(K) R1.1 R9.2
NetD2_2: D2.2(A) Q1.1(G) R1.2 R4.2
NetD5_2: D5.2(A) Q3.3(S) T2.3
NetD6_1: D6.1(K) R7.2 R10.1
NetD6_2: D6.2(A) Q3.1(G) R10.2 R11.2
NetD7_1: D7.1(K) R16.1 U3.4(IN-)
NetQ2_1: Q2.1(G) R5.2 R6.2
NetR7_1: R7.1 U1.5(OUT)
NetR9_1: R9.1 U2.5(OUT)
NetR13_2: R13.2 R17.1
NetR15_1: R15.1 R18.2
NetR17_2: R17.2 R21.2
NetR18_1: R18.1 R23.2
NetR19_2: R19.2 R20.1
NetR25_2: R25.2 U4.3(TSET)
NetR34_2: R34.2 R35.1
NetR35_2: R35.2 R36.1

### Layout directives
mark named HV: +390V, NET_A, NetBR1_1, NetD1_2, VAC

### Notes on the sheet
- File:
- Title:
- Date:
- Page
- Num:
- Total:
- Drawn By: Huzaifa Ali